# Altium schematic sheet RF Triangulation Receiver.SchDoc
size A; SheetNumber: 1; SheetTotal: 1
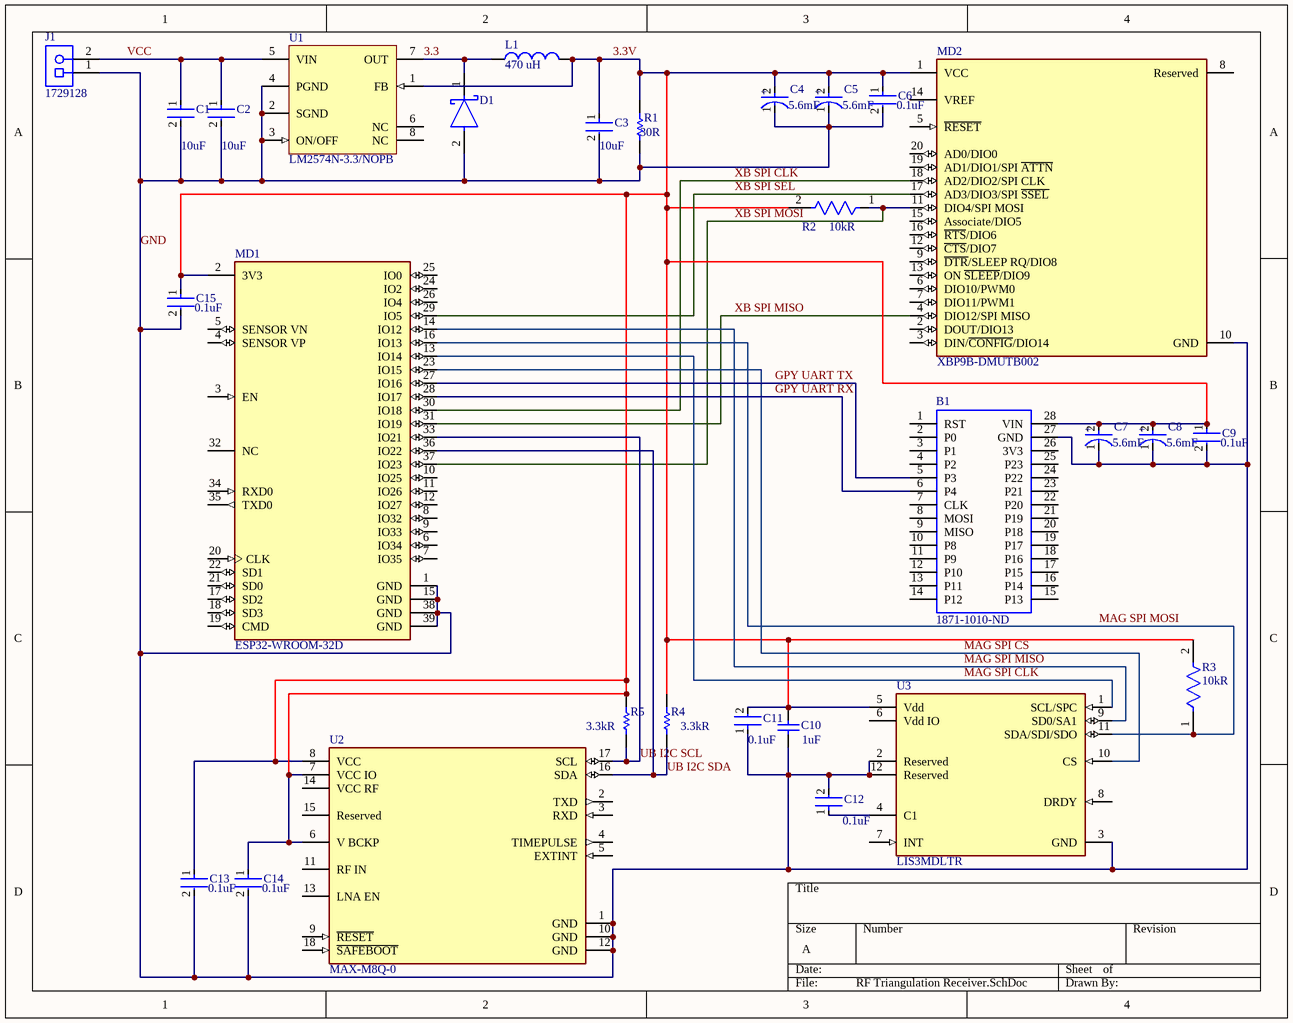
[diagram p0: RF Triangulation Receiver.SchDoc]

## Parts
B1  1871-1010-ND  [18711010ND]
C1  Capacitance: 10uF  [FP-RDE2M1-MFG]  (hidden comment: RDEC71E106K2K1H03B)
C2  Capacitance: 10uF  [FP-RDE2M1-MFG]  (hidden comment: RDEC71E106K2K1H03B)
C3  Capacitance: 10uF  [FP-RDE2M1-MFG]  (hidden comment: RDEC71E106K2K1H03B)
C4  Capacitance: 5.6mF  [FP-RAD-TH-D_16_0_5-L_20_2-MFG]  (hidden comment: EEUFM0J562S)
C5  Capacitance: 5.6mF  [FP-RAD-TH-D_16_0_5-L_20_2-MFG]  (hidden comment: EEUFM0J562S)
C6  Capacitance: 0.1uF  [FP-RCE0K1-MFG]  (hidden comment: RCER71E104K0K1H03B)
C7  Capacitance: 5.6mF  [FP-RAD-TH-D_16_0_5-L_20_2-MFG]  (hidden comment: EEUFM0J562S)
C8  Capacitance: 5.6mF  [FP-RAD-TH-D_16_0_5-L_20_2-MFG]  (hidden comment: EEUFM0J562S)
C9  Capacitance: 0.1uF  [FP-RCE0K1-MFG]  (hidden comment: RCER71E104K0K1H03B)
C10  Capacitance: 1uF  [CAPC2013X140X50ML20T25]  (hidden comment: 0805YC105JAT2A)
C11  Capacitance: 0.1uF  [FP-RCE0K1-MFG]  (hidden comment: RCER71E104K0K1H03B)
C12  Capacitance: 0.1uF  [FP-RCE0K1-MFG]  (hidden comment: RCER71E104K0K1H03B)
C13  Capacitance: 0.1uF  [FP-RCE0K1-MFG]  (hidden comment: RCER71E104K0K1H03B)
C14  Capacitance: 0.1uF  [FP-RCE0K1-MFG]  (hidden comment: RCER71E104K0K1H03B)
C15  Capacitance: 0.1uF  [FP-RCE0K1-MFG]  (hidden comment: RCER71E104K0K1H03B)
D1  BAT60AE6327HTSA1  [FP-PG-SOD323-2-IPC_C]  (value not drawn)
J1  1729128  [PHOE-1729128-2_V]
L1  LR: 470 uH  [EPCS-B78108S-2_V1]  (hidden comment: B78108S1474J)
MD1  ESP32-WROOM-32D  [FP-ESP32-WROOM-32D-MFG]
MD2  XBP9B-DMUTB002  [FP-XBP9B-DMUTB002-MFG]
R1  Resistance: 30R  [RESC1005X40X25LL05T05]  (hidden comment: ERJ-2RKF30R0X)
R2  Resistance: 10kR  [FP-CR0805-IPC_A]  (hidden comment: CR0805-FX-1002ELF)
R3  Resistance: 10kR  [FP-CR0805-IPC_A]  (hidden comment: CR0805-FX-1002ELF)
R4  Resistance: 3.3kR  [RESC1608X55X30NL20T10]  (hidden comment: RK73H1JTTD3301F)
R5  Resistance: 3.3kR  [RESC1608X55X30NL20T10]  (hidden comment: RK73H1JTTD3301F)
U1  LM2574N-3.3/NOPB  [P0008A]
U2  MAX-M8Q-0  [FP-MAX-M8Q-0-MFG]
U3  LIS3MDLTR  [FP-VFLGA-12-8365767-MFG]

## Nets
3.3: D1.1(C) L1.1 U1.7(OUT)
3.3V: B1.28(VIN) C3.1 C4.2(A) C5.2(A) C6.1 C7.2(A) C8.2(A) C9.1 C10.2 C11.2 C13.1 C14.1 C15.1 L1.2 MD1.2(3V3) MD2.1(VCC) R1.2 R2.2 R3.2 R4.2 R5.2 U1.1(FB) U2.6(V_BCKP) U2.7(VCC_IO) U2.8(VCC) U3.5(Vdd)
GND: B1.27(GND) C1.2 C2.2 C3.2 C4.1(C) C5.1(C) C6.2 C7.1(C) C8.1(C) C9.2 C10.1 C11.1 C12.2 C13.2 C14.2 C15.2 D1.2(A) J1.1 MD1.1(GND) MD1.15(GND) MD1.38(GND) MD1.39(GND) MD2.10(GND) R1.1 U1.2(SGND) U1.3(ON/OFF) U1.4(PGND) U2.1(GND) U2.10(GND) U2.12(GND) U3.2(Reserved) U3.3(GND) U3.12(Reserved)
GPY UART RX: B1.6(P4) MD1.28(IO17)
GPY UART TX: B1.5(P3) MD1.27(IO16)
MAG SPI CLK: MD1.13(IO14) U3.1(SCL/SPC)
MAG SPI CS: MD1.23(IO15) U3.10(CS)
MAG SPI MISO: MD1.14(IO12) U3.9(SD0/SA1)
MAG SPI MOSI: MD1.16(IO13) R3.1 U3.11(SDA/SDI/SDO)
UB I2C SCL: MD1.33(IO21) R5.1 U2.17(SCL)
UB I2C SDA: MD1.36(IO22) R4.1 U2.16(SDA)
VCC: C1.1 C2.1 J1.2 U1.5(VIN)
XB SPI CLK: MD1.30(IO18) MD2.18(AD2/DIO2/SPI_CLK)
XB SPI MISO: MD1.31(IO19) MD2.4(DIO12/SPI_MISO)
XB SPI MOSI: MD1.37(IO23) MD2.11(DIO4/SPI_MOSI) R2.1
XB SPI SEL: MD1.29(IO5) MD2.17(AD3/DIO3/SPI_~{SSEL})
NetC12_1: C12.1 U3.4(C1)

Not connected (* = marked no-connect by the designer): B1 1(RST) 2(P0) 3(P1) 4(P2) 7(CLK) 8(MOSI) 9(MISO) 10(P8) 11(P9) 12(P10) 13(P11) 14(P12) 15(P13) 16(P14) 17(P15) 18(P16) 19(P17) 20(P18) 21(P19) 22(P20) 23(P21) 24(P22) 25(P23) 26(3V3); MD1 3(EN) 4(SENSOR_VP) 5(SENSOR_VN) 6(IO34) 7(IO35) 8(IO32) 9(IO33) 10(IO25) 11(IO26) 12(IO27) 17(SD2) 18(SD3) 19(CMD) 20(CLK) 21(SD0) 22(SD1) 24(IO2) 25(IO0) 26(IO4) 32(NC) 34(RXD0) 35(TXD0); MD2 2(DOUT/DIO13) 3(DIN/~{CONFIG}/DIO14) 5(~{RESET}) 6(DIO10/PWM0) 7(DIO11/PWM1) 8(Reserved) 9(~{DTR}/SLEEP_RQ/DIO8) 12(~{CTS}/DIO7) 13(ON_~{SLEEP}/DIO9) 14(VREF) 15(Associate/DIO5) 16(~{RTS}/DIO6) 19(AD1/DIO1/SPI_~{ATTN}) 20(AD0/DIO0); U1 6(NC) 8(NC); U2 2(TXD) 3(RXD) 4(TIMEPULSE) 5(EXTINT) 9(~{RESET}) 11(RF_IN) 13(LNA_EN) 14(VCC_RF) 15(Reserved) 18(~{SAFEBOOT}); U3 6(Vdd_IO) 7(INT) 8(DRDY)

## Notes on the sheet
- (in symbol CMP-05427-001489-1) +

## Library data of the parts
B1 = 1871-1010-ND: - ESP32, G01 Transceiver; 802.11 b/g/n (Wi-Fi, WiFi, WLAN), Bluetooth Smart Ready 4.x Dual Mode 2.4GHz Evaluation Board; Manufacturer_Name: Pycom; Geometry.Height: 5.8mm; Manufacturer_Part_Number: 1871-1010-ND; Mouser Part Number: *; Mouser Price/Stock: *; Arrow Part Number: *; Arrow Price/Stock: *; Mouser Testing Part Number: *; Mouser Testing Price/Stock: *; Datasheet Link: https://docs.pycom.io/gitbook/assets/specsheets/Pycom_002_Specsheets_GPy_v2.pdf
C1-C3 = CMP-06035-050717-1: Ceramic Capacitor 10uF ±10% 25V X7S Radial; Lead/Base Style: Formed Leads; Lead Diameter: 0.5mm; Max Operating Temperature: 125°C; Voltage Rating (DC): 25V; Tolerance: 10%; Termination: Radial; Packaging: Bulk; Voltage Rating: 25V; Mount: Through Hole; Case/Package: Radial; Height: 4mm; Resistor Type: Ceramic; Package Quantity: 500; Dielectric: X7S; Height - Seated (Max): 0.236inch; Length: 5.5mm; Width: 0.124inch; Lead Free: Lead Free; Lead Pitch: 0.197inch; Min Operating Temperature: -55°C
C4 C5 C7 C8 = CMP-05427-001489-1: Aluminum Electrolytic Capacitors (Radial Lead Type) 5600uF ±20% 6.3V; ESR (Equivalent Series Resistance): 17mR; Ripple Current: 3.3A; Lead/Base Style: Straight; Dissipation Factor: 0.22%; Lead Diameter: 0.8mm; Life (Hours): 5000Hour; Lead Free: Lead Free; Construction: RADIAL; Voltage Rating (DC): 6.3V; Tolerance: 20%; Voltage: 6.3V; Height: 20mm; Radiation Hardening: No; Case/Package: Radial; Series: FM; Package Quantity: 100; Length: 20mm; Packaging: Bulk; Diameter: 16mm; Mount: Through Hole; Termination: Radial; Height - Seated (Max): 0.866inch; Min Operating Temperature: -40°C; Impedance: 17mR; RoHS Compliant: Yes; Max Operating Temperature: 105°C; Lead Pitch: 7.5mm; Voltage Rating: 6.3V; REACH SVHC: No SVHC
C6 C9 C11-C15 = CMP-06035-038410-1: Cap Ceramic 100nF 25V X7R ±10% Radial 5mm +125°C Automotive Bulk
C10 = CMP-1036-04744-2: Manufacturer: AVX Interconnect / Elco; Part Number: 0805YC105JAT2A
D1 = CMP-32890-000004-1: DIODE SCHOTTKY 10V 3A SOD323-2; Forward Voltage: 370mV; Polarity: Standard; Peak Non-Repetitive Surge Current: 5A; Element Configuration: Single; Max Operating Temperature: 85°C; Current Rating: 3A; Number of Pins: 2; Mount: Surface Mount; Forward Current: 3A; Max Reverse Voltage (DC): 10V; Output Current: 3A; Contact Plating: Tin; Average Rectified Current: 3A; Lead Free: Lead Free; Max Repetitive Reverse Voltage (Vrrm): 10V; Voltage Rating (DC): 10V; Radiation Hardening: No; Halogen Free: Not Halogen Free; Case/Package: SOD-323-2; REACH SVHC: No SVHC; Min Operating Temperature: -55°C; Packaging: Tape and Reel
J1 = CMP-2000-05815-1: PCB Terminal Block, 13.5 A, 400 V, 2-Pin THD, RoHS, Bulk; Manufacturer: Phoenix Contact; Package Version: 03/2015; No. of Rows: 1; Pitch: 5.08mm; No. of Positions: 2; Voltage Rating: 400V; Current Rating: 13500mA; Manufacturer URL: http://www.phoenixcontact.com/; Datasheet URL: https://datasheet.ciiva.com/16046/1729128-16046181.pdf; RoHS: TRUE; Package URL: https://www.phoenixcontact.com/online/portal/pi/pxc/product_detail_page/!ut/p/b1/3VdJjqNKFDxLH8AFycySyWY2ozFsEPOMMQaDOX1XedGL_1Vdm5YXJleknhSKeBkvI6EA8ncAo3AYoDhBQGco6KN7VURTdemj9us_IEKEZo_YHiPAEWEFmDGOHMORkqKYCORBZxgL7ZoaZYcbFFUZ3fqxSY6GOuxydWUuHqz1ynmMFygu583Bob0Ewr6Sd_l-5m-kAueHiB0jpRwZwe58wwtkpxtMYd_LmGcDRU02dRNEyWt6Y2ti5pSyJ_reIkzIulrqApdnbT11V5jnCKbYNCvhEM1MCpPByat_X379-iThf08CI5GfOPqfBeS3BRoBOdD55AKVv0iLwCMq-2BrzXWSGRH7pUGD9uwXQjiph3xL0DKQwdGa0JImiIOmBNOestqgwTHSSs2oOep-78apyXQBvNi8ZLaFjvjWvcaUEBu0MC6Wbe-d6mB0FAebo2lUWinqYaZs5DAYzV0RP9yitUjnGJ0iI9xhZkT42OCQNUJJhkgWINNQLP2JFP6OpMg3JCVg70jqHT0lvKOnhHf0lPuOnnLf0VPuWx6_dxwUIvwk5WMkT0kLL1mh61l2yZVSzG3pYV_bqo-mj6uMKwKwdnnW8Jh5RTOJzMOA5c-eJDaZQw4mTMPH02PvS_ZAqNVjVTo2WyYLkwH_KU1mmmG5kjRhDqPXLwwVHvVOjCM60-fpXvTDfMGW1PVFVS1r4e4yVDk4ZdNbkUHvqPqQSeian4UD39fNKmachqdJ1NJbyk8rXT9mXTvPk3oE5meulKGgiruPJek-4I9hTT6G8ZLOyRSm2RRVbThERQad5OS28hdt4YW4vG0stgYYzsWsK4_7y6DZMjJSCqri1kyiZR5vD7pwIrNR7QwPHTcLTI5qT7eRlpHrdGiupYlqQDJ7zy_CND8fWWBoLRXxk1RVcXiBQwbTD4Xi7KL-FuO94t9xaqweXzH; PartNumber: 1729128; Package Description: 2-Pin Through Hole Device, Body 8.1 x 10.16 mm, Pitch 5.08 mm; Datasheet Version: 12/2013; Mounting Technology: ThroughHole; Orientation: Horizontal; Package Reference: 1729128-2; Packing: Bulk
L1 = CMP-0816-00001-1: RF Choke, 470 uH +/- 5%, 170 mA, Dia 4 mm, Length 9.2 mm, Axial Leads, RoHS, Tape and Reel; Manufacturer: EPCOS; IR: 170 mA; Q: 70 Min.; R: 7.9 Ohm Max.; Fres: 2.2 MHz Min.; Tolerance: +/- 5%; FQ: 0.796 MHz; ComponentLink2Description: Datasheet; RoHS: TRUE; PackageReference: B78108S-2; ComponentLink2URL: http://www.epcos.com/inf/30/db/ind_2008/b78108_148s.pdf; DatasheetVersion: Jun-12; Mounting Technology: Through Hole; PackageDescription: 2-Pin RF Choke, Dia 4 mm, Length 9.2 mm; ComponentLink1Description: Manufacturer URL; ComponentLink1URL: http://www.epcos.com/; PartNumber: B78108S1474J; Packing: Tape and Reel
MD1 = CMP-194065-000003-1: WIFI MODULE 32MBITS SPI FLASH; Manufacturer: Espressif Systems; Max Supply Voltage: 3.6V; Nominal Supply Current: 500mA; Max Frequency: 2484MHz; Number Of Adc Channels: 16; Number Of Gpio: 32; Interface: I2C,SPI,UART,Ethernet,I2S,Other; Data Rate: 150Mbits/s; Min Supply Voltage: 3V; Bandwidth: 72MHz; Sensitivity: -98dBm; Octopart: https://octopart.com/esp32-wroom-32d-espressif+systems-91040050; Package: ESP32-WROOM-32D; ComponentLink2URL: https://www.espressif.com/sites/default/files/documentation/esp32-wroom-32d_esp32-wroom-32u_datasheet_en.pdf; Lead Free: Yes; Category: UNK; Mouser Description: Wi-Fi/BT BLE Module ESP32-D0WD, SPI Flash, UART, P; Device Class L1: Integrated Circuits (ICs); RoHS: TRUE; Temperature Range Low: -40°C; ComponentLink2Description: Datasheet; Digikey Description: WIFI MODULE 32MBITS SPI FLASH; Height: 3.2mm; Temperature: -40°C to +85°C; Manufacturer Part Number: ESP32-WROOM-32D; Device Class L3: Transceivers; Device Class L2: RF Semiconductors and Devices; Temperature Range High: +85°C; Automotive: No
MD2 = CMP-84319-000004-1: RX TXRX MOD ISM < 1GHZ U.FL TH; Max Supply Voltage: 3.6V; Current - Transmitting: 215mA; Sensitivity: -101dBm; Min Frequency: 902MHz; Memory Size: 2KB; Max Frequency: 928MHz; Min Supply Voltage: 2.4V; Current - Receiving: 29mA; Interface: SPI; Data Rate: 200Kbps; Frequency: 900MHz; Output Power (dBm): 24dBm; Number of Pins: 20; Series: XBee-Pro™; Max Operating Temperature: 85°C; Radiation Hardening: No; Min Operating Temperature: -40°C; Package Quantity: 1; RAM Size: 2KB; Packaging: Bulk; Case/Package: Module
R1 = CMP-2002-00857-1: Manufacturer: Panasonic; Part Number: ERJ-2RKF30R0X
R2 R3 = CMP-07231-003204-1: Thick Film Chip Resistors 0805 10kΩ 0.125W 1% 100ppm/°C; Max Power Dissipation: 125mW; Voltage Rating: 150V; Voltage Rating (DC): 100V; Height: 0.5mm; Tolerance: 1%; Max Operating Temperature: 155°C; Thickness: 508um; Radiation Hardening: No; Packaging: Tape and Reel; Depth: 1.25mm; Contact Plating: Tin; Package Quantity: 1; Case Code (Metric): 2012; REACH SVHC: No SVHC; Min Operating Temperature: -55°C; Power Rating: 125mW; Mount: Surface Mount; Length: 2mm; Case Code (Imperial): 0805; Width: 1.25mm; Temperature Coefficient: 100ppm/°C; Termination: SMD/SMT; Composition: Thick Film; Features: Moisture Resistant; Case/Package: 0805; Number of Terminations: 2
R4 R5 = CMP-2000-01423-1: Manufacturer: KOA Speer; Part Number: RK73H1JTTD3301F
U1 = CMP-0069-00460-3: SIMPLE SWITCHER® 0.5A Step-Down Voltage Regulator, 8-pin MDIP, Pb-Free; Manufacturer: Texas Instruments; PackageTopMarking: NSUZXYTTE#*LM2574N*-3.3 P+; PowerWise: N; CompType: Switcher; PackageReference: P0008A; ComponentLink1URL: http://www.ti.com/general/docs/lit/getliterature.tsp?genericPartNumber=LM2574&fileType=pdf; PinCount: 8; RoHS: Y; ComponentLink1Description: Datasheet URL; Code_JEDEC: MS-001-BA; PackageDescription: MDIP, .365 x .250 x .130in, 8 Lead, .100in Pitch
U2 = CMP-207130-000017-1: RF RCVR GNSS/GPS 1.575GHZ 18LCC; Sensitivity: -167dBm; Current - Receiving: 23mA; Interface: I2C; Frequency: 1.575GHz; Min Operating Temperature: -40°C; Case/Package: SMD/SMT; RoHS Compliant: Yes; Packaging: Cut Tape; Max Operating Temperature: 85°C
U3 = CMP-2000-07463-2: SENSOR MR I2C/SPI 12LGA; Manufacturer: STMicroelectronics; Sensor Output: I2C,SPI; Operating Supply Current: 40-270uA; Max Supply Voltage: 3.6V; Sensing Method: Magnetic; Min Supply Voltage: 1.71V; ComponentLink2URL: https://www.st.com/resource/en/datasheet/lis3mdl.pdf; Category: IC; Manufacturer Part Number: LIS3MDLTR; Octopart: https://octopart.com/lis3mdltr-stmicroelectronics-29403125; Automotive: No; ComponentLink2Description: Datasheet; RoHS: TRUE; Device Class L3: unset; Device Class L1: Sensors; Temperature: -40°C to +85°C; Height: 1mm; Mouser Description: Board Mount Hall Effect / Magnetic Sensors Ultra Lo-Pwr Hi Perf 3-Axis 1.9-3.6V; Temperature Range High: +85°C; Lead Free: Yes; Device Class L2: Magnetic Sensors; Footprint Url: https://www.st.com/content/ccc/resource/technical/document/technical_note/73/17/9c/16/dd/96/4a/01/CD00134799.pdf/files/CD00134799.pdf/jcr:content/translations/en.CD00134799.pdf; Temperature Range Low: -40°C; Package: VFLGA-12-8365767; Digikey Description: SENSOR MR I2C/SPI 12LGA